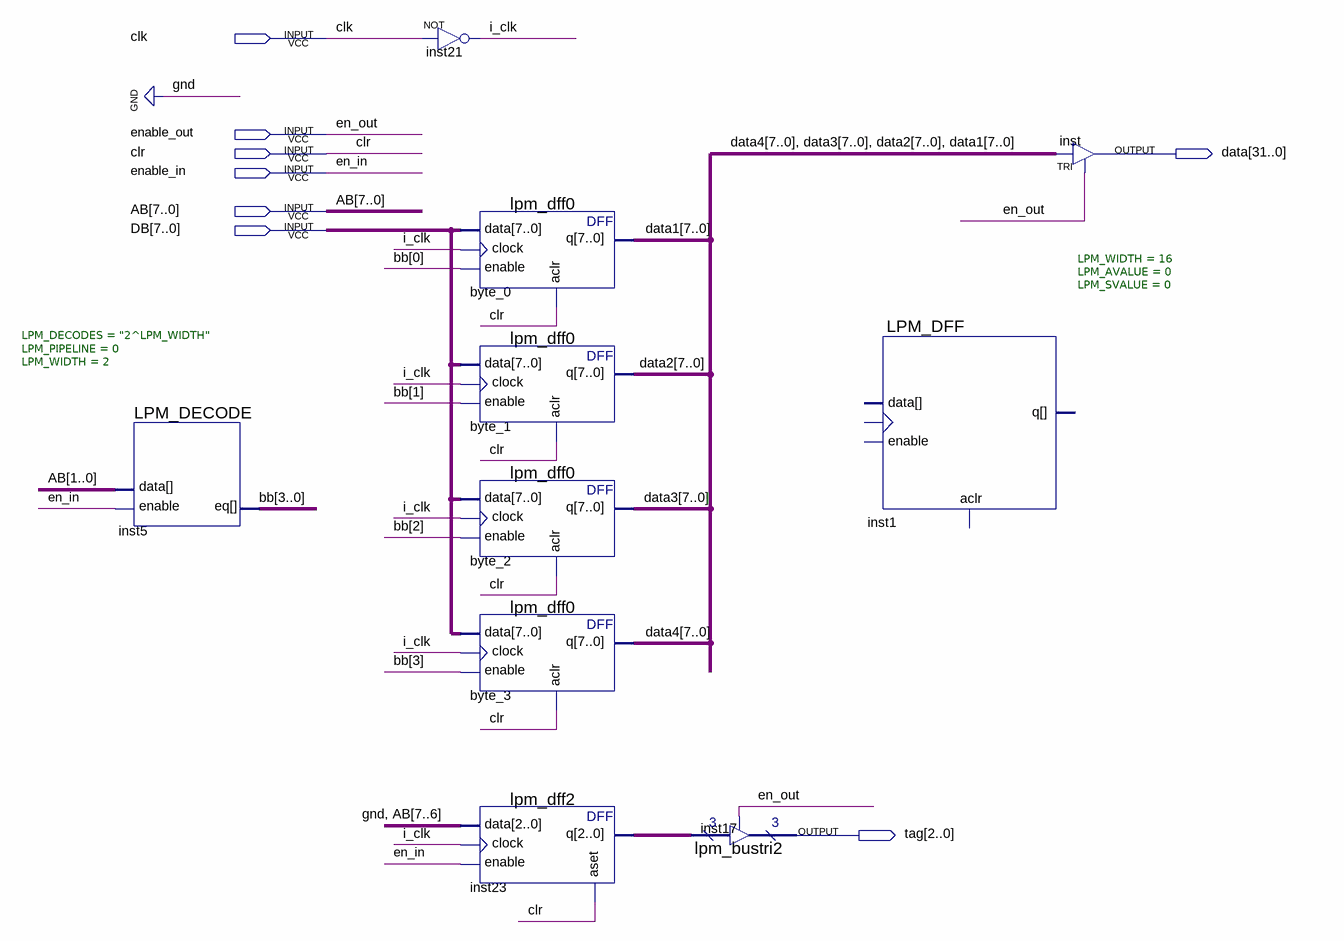
[diagram p0: schematic sheet]
// Quartus schematic cache_line.bdf as structural Verilog: 10 symbols, 8 pins
module cache_line (
  input  clk,
  input  enable_out,
  input  clr,
  input  enable_in,
  input  [7:0] AB,
  input  [7:0] DB,
  output [31:0] data,
  output [2:0] tag
);

  wire i_clk;
  wire [2:0] inst23_q;
  wire [3:0] bb;
  wire [7:0] data1, data2, data3, data4;

  LPM_DECODE #(.LPM_DECODES("2^LPM_WIDTH"), .LPM_PIPELINE(0), .LPM_WIDTH(2)) inst5 (
    .enable(enable_in), .data(AB[1:0]), .eq(bb));
  not inst21 (i_clk, clk);
  lpm_dff0 byte_0 (.data(DB), .clock(i_clk), .enable(bb[0]), .aclr(clr), .q(data1));
  lpm_dff0 byte_1 (.data(DB), .clock(i_clk), .enable(bb[1]), .aclr(clr), .q(data2));
  lpm_dff0 byte_2 (.data(DB), .clock(i_clk), .enable(bb[2]), .aclr(clr), .q(data3));
  lpm_dff0 byte_3 (.data(DB), .clock(i_clk), .enable(bb[3]), .aclr(clr), .q(data4));
  lpm_dff2 inst23 (.data({1'b0, AB[7:6]}), .clock(i_clk), .enable(enable_in), .aset(clr), .q(inst23_q));
  lpm_bustri2 inst17 (.enabledt(enable_out), .data(inst23_q), .tridata(tag));
  LPM_DFF #(.LPM_WIDTH(16), .LPM_AVALUE(0), .LPM_SVALUE(0)) inst1 ();  // open: enable, clock, data, aclr, q
  TRI inst[31:0] (.IN({data4, data3, data2, data1}), .OE(enable_out), .OUT(data));

  // Other names for the same wires on the sheet: en_in = enable_in; en_out = enable_out
endmodule
